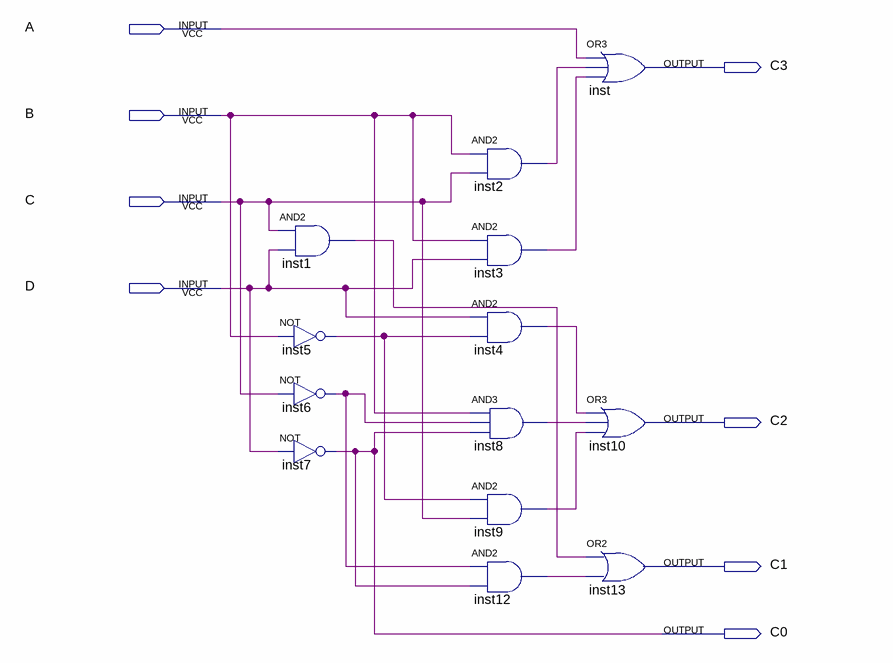
[diagram p0: schematic sheet]
// Quartus schematic lab3.bdf as structural Verilog: 13 symbols, 8 pins
module lab3 (
  input  A,
  input  B,
  input  C,
  input  D,
  output C3,
  output C2,
  output C1,
  output C0
);

  wire inst1_out, inst2_out, inst3_out, inst4_out, inst5_out, inst6_out, inst8_out, inst9_out, inst12_out;

  and inst1 (inst1_out, C, D);
  not inst5 (inst5_out, B);
  not inst6 (inst6_out, C);
  not inst7 (C0, D);
  and inst2 (inst2_out, B, C);
  and inst3 (inst3_out, B, D);
  and inst4 (inst4_out, D, inst5_out);
  and inst8 (inst8_out, B, inst6_out, C0);
  and inst9 (inst9_out, inst5_out, C);
  and inst12 (inst12_out, inst6_out, C0);
  or inst (C3, A, inst2_out, inst3_out);
  or inst10 (C2, inst4_out, inst8_out, inst9_out);
  or inst13 (C1, inst1_out, inst12_out);
endmodule
